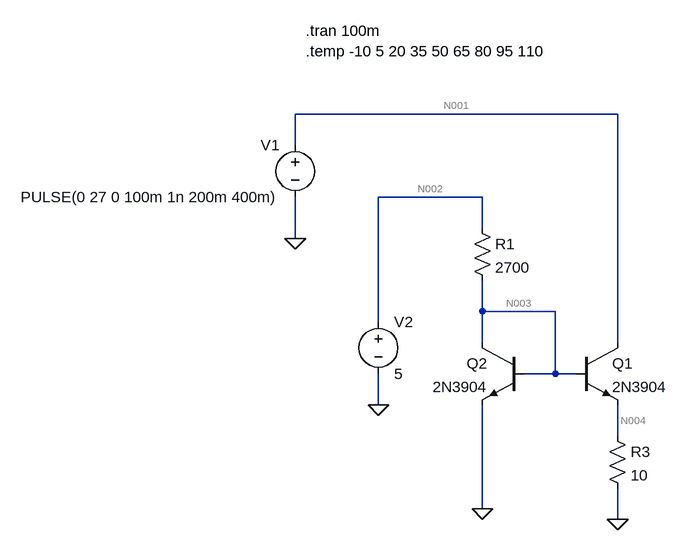
[diagram p0: schematic constant_current_load.asc]
constant_current_load.asc, the LTspice schematic file:
Version 4
SHEET 1 880 680
WIRE 192 -144 -304 -144
WIRE -304 -96 -304 -144
WIRE -16 -16 -176 -16
WIRE -16 32 -16 -16
WIRE -304 48 -304 -16
WIRE -16 160 -16 112
WIRE 96 160 -16 160
WIRE -176 176 -176 -16
WIRE -16 208 -16 160
WIRE 192 208 192 -144
WIRE 96 256 96 160
WIRE 96 256 48 256
WIRE 128 256 96 256
WIRE -176 304 -176 256
WIRE 192 352 192 304
WIRE -16 464 -16 304
WIRE 192 480 192 432
FLAG -16 464 0
FLAG -304 48 0
FLAG -176 304 0
FLAG 192 480 0
SYMBOL voltage -304 -112 M0
WINDOW 123 0 0 Left 0
WINDOW 39 0 0 Left 0
SYMATTR InstName V1
SYMATTR Value PULSE(0 27 0 100m 1n 200m 400m)
SYMBOL voltage -176 160 R0
WINDOW 123 0 0 Left 0
WINDOW 39 0 0 Left 0
SYMATTR InstName V2
SYMATTR Value 5
SYMBOL res -32 16 R0
SYMATTR InstName R1
SYMATTR Value 2700
SYMBOL npn 128 208 R0
SYMATTR InstName Q1
SYMATTR Value 2N3904
SYMBOL res 176 336 R0
SYMATTR InstName R3
SYMATTR Value 10
SYMBOL npn 48 208 M0
SYMATTR InstName Q2
SYMATTR Value 2N3904
TEXT -288 -272 Left 2 !.tran 100m\n.temp -10 5 20 35 50 65 80 95 110

The netlist it stands for:
* constant_current_load.asc
V1 N001 0 PULSE(0 27 0 100m 1n 200m 400m)
V2 N002 0 5
R1 N002 N003 2700
Q1 N001 N003 N004 0 2N3904
R3 N004 0 10
Q2 N003 N003 0 0 2N3904
.model NPN NPN
.model PNP PNP
.lib standard.bjt
.tran 100m
.temp -10 5 20 35 50 65 80 95 110
.backanno
.end

* Results of the author's LTspice run, read from the files saved beside the schematic
* Operating Point (first step), zero values left out:
*   temperature = -10 
*   V(n002) = 5 V
*   V(n003) = 725.9 mV
*   V(n004) = 36.9 µV
*   Ic(Q2) = 1.274 mA
*   Ib(Q2) = 5.188 µA
*   Ie(Q2) = -1.279 mA
*   Ic(Q1) = -300.5 µA
*   Ib(Q1) = 304.2 µA
*   Ie(Q1) = -3.69 µA
*   I(R3) = 3.69 µA
*   I(R1) = 1.583 mA
*   I(V2) = -1.583 mA
*   I(V1) = 300.5 µA
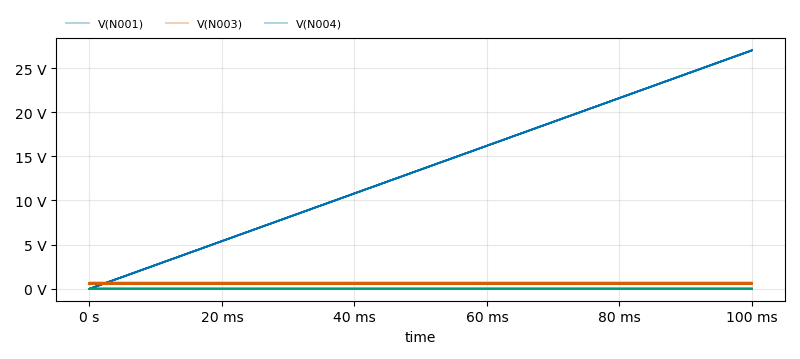
[diagram p1: Transient Analysis of constant_current_load.asc, plotted from the saved traces]
* Transient Analysis, 9 runs:
*   V(N001) [temp=-10°C]: min 0 V, max 27 V, average 13.5 V, rms 18.76 V, last 27 V
*   V(N001) [temp=5°C]: min 0 V, max 27 V, average 13.5 V, rms 18.76 V, last 27 V
*   V(N001) [temp=20°C]: min 0 V, max 27 V, average 13.5 V, rms 18.76 V, last 27 V
*   V(N001) [temp=35°C]: min 0 V, max 27 V, average 13.5 V, rms 18.72 V, last 27 V
*   V(N001) [temp=50°C]: min 0 V, max 27 V, average 13.5 V, rms 18.74 V, last 27 V
*   V(N001) [temp=65°C]: min 0 V, max 27 V, average 13.5 V, rms 18.74 V, last 27 V
*   V(N001) [temp=80°C]: min 0 V, max 27 V, average 13.5 V, rms 18.75 V, last 27 V
*   V(N001) [temp=95°C]: min 0 V, max 27 V, average 13.5 V, rms 17.39 V, last 27 V
*   V(N003) [temp=-10°C]: min 725.9 mV, max 730.8 mV, average 730.8 mV, rms 730.8 mV, last 730.8 mV
*   V(N003) [temp=5°C]: min 700.4 mV, max 705.3 mV, average 705.3 mV, rms 705.3 mV, last 705.3 mV
*   V(N003) [temp=20°C]: min 674.8 mV, max 679.6 mV, average 679.6 mV, rms 679.6 mV, last 679.6 mV
*   V(N003) [temp=35°C]: min 648.9 mV, max 653.8 mV, average 653.8 mV, rms 653.8 mV, last 653.8 mV
*   V(N003) [temp=50°C]: min 622.9 mV, max 627.8 mV, average 627.7 mV, rms 627.7 mV, last 627.8 mV
*   V(N003) [temp=65°C]: min 596.8 mV, max 601.6 mV, average 601.6 mV, rms 601.6 mV, last 601.6 mV
*   V(N003) [temp=80°C]: min 570.5 mV, max 575.2 mV, average 575.2 mV, rms 575.2 mV, last 575.2 mV
*   V(N003) [temp=95°C]: min 544 mV, max 548.7 mV, average 548.7 mV, rms 548.7 mV, last 548.7 mV
*   V(N004) [temp=-10°C]: min 36.9 µV, max 11.86 mV, average 10.97 mV, rms 11 mV, last 11.86 mV
*   V(N004) [temp=5°C]: min 35.43 µV, max 12.13 mV, average 11.21 mV, rms 11.25 mV, last 12.13 mV
*   V(N004) [temp=20°C]: min 34.03 µV, max 12.4 mV, average 11.44 mV, rms 11.48 mV, last 12.4 mV
*   V(N004) [temp=35°C]: min 32.72 µV, max 12.65 mV, average 11.67 mV, rms 11.71 mV, last 12.65 mV
*   V(N004) [temp=50°C]: min 31.47 µV, max 12.9 mV, average 11.89 mV, rms 11.93 mV, last 12.9 mV
*   V(N004) [temp=65°C]: min 30.3 µV, max 13.14 mV, average 12.1 mV, rms 12.15 mV, last 13.14 mV
*   V(N004) [temp=80°C]: min 29.19 µV, max 13.37 mV, average 12.31 mV, rms 12.35 mV, last 13.37 mV
*   V(N004) [temp=95°C]: min 28.15 µV, max 13.6 mV, average 12.52 mV, rms 12.55 mV, last 13.6 mV